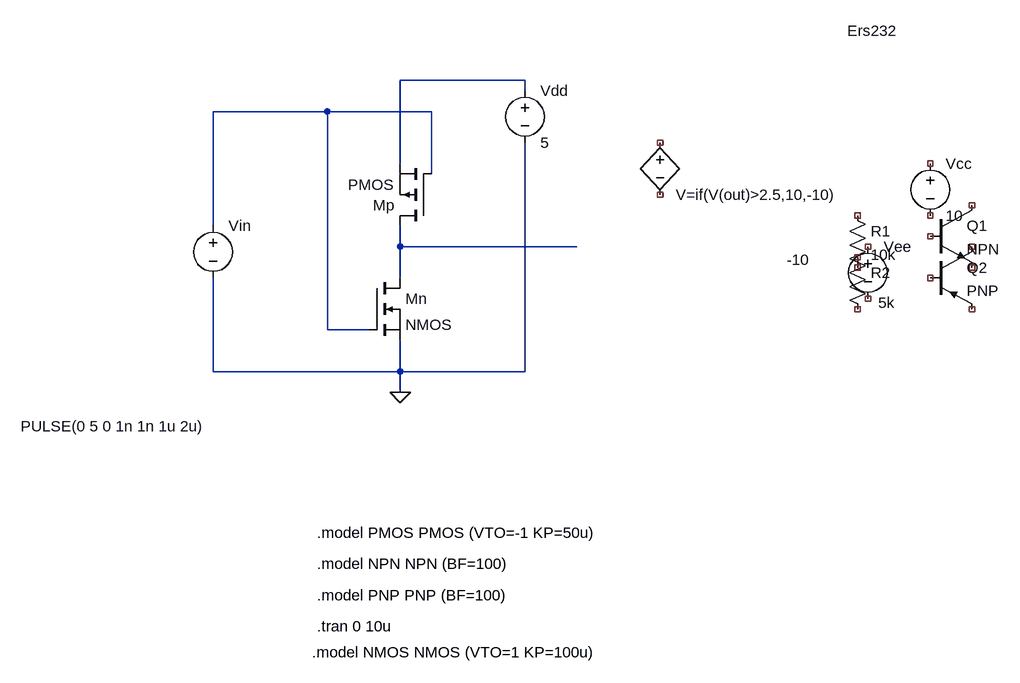
[diagram p0: schematic rs232_chain.asc]
rs232_chain.asc, the LTspice schematic file:
Version 4.1
SHEET 1 1096 832
WIRE 336 -64 144 -64
WIRE 336 -48 336 -64
WIRE 32 -16 -144 -16
WIRE 192 -16 32 -16
WIRE 144 64 144 -64
WIRE 192 80 192 -16
WIRE -144 160 -144 -16
WIRE 144 192 144 160
WIRE 416 192 144 192
WIRE 144 240 144 192
WIRE 32 320 32 -16
WIRE 96 320 32 320
WIRE -144 384 -144 240
WIRE 144 384 144 336
WIRE 144 384 -144 384
WIRE 336 384 336 32
WIRE 336 384 144 384
WIRE 144 416 144 384
FLAG 144 416 0
SYMBOL voltage -144 144 R0
WINDOW 123 0 0 Left 0
WINDOW 3 -296 324 Left 2
SYMATTR InstName Vin
SYMATTR Value PULSE(0 5 0 1n 1n 1u 2u)
SYMBOL voltage 336 -64 R0
WINDOW 123 0 0 Left 0
SYMATTR InstName Vdd
SYMATTR Value 5
SYMBOL nmos 96 240 R0
SYMATTR InstName Mn
SYMBOL pmos 192 160 R180
WINDOW 3 58 63 Left 2
SYMATTR InstName Mp
SYMBOL bv 544 16 R0
WINDOW 0 288 -156 Left 2
SYMATTR InstName Ers232
SYMATTR Value V=if(V(out)>2.5,10,-10)
SYMBOL res 832 128 R0
SYMATTR InstName R1
SYMATTR Value 10k
SYMBOL res 832 192 R0
WINDOW 3 48 86 Left 2
SYMATTR InstName R2
SYMATTR Value 5k
SYMBOL npn 960 128 R0
SYMATTR InstName Q1
SYMBOL pnp 960 192 R0
SYMATTR InstName Q2
SYMBOL voltage 960 48 R0
SYMATTR InstName Vcc
SYMATTR Value 10
SYMBOL voltage 864 176 R0
WINDOW 3 -125 36 Left 2
SYMATTR InstName Vee
SYMATTR Value -10
TEXT 8 816 Left 2 !.model NMOS NMOS (VTO=1 KP=100u)
TEXT 16 632 Left 2 !.model PMOS PMOS (VTO=-1 KP=50u)
TEXT 16 680 Left 2 !.model NPN NPN (BF=100)
TEXT 16 728 Left 2 !.model PNP PNP (BF=100)
TEXT 16 776 Left 2 !.tran 0 10u

The netlist it stands for:
* rs232_chain.asc
Vin N002 0 PULSE(0 5 0 1n 1n 1u 2u)
Vdd N001 0 5
Mn N003 N002 0 0 NMOS
Mp N003 N002 N001 N001 PMOS
B§Ers232 NC_01 NC_02 V=if(V(out)>2.5,10,-10)
R1 NC_03 NC_04 10k
R2 NC_05 NC_06 5k
Q1 NC_07 NC_08 NC_09 0 NPN
Q2 NC_10 NC_11 NC_12 0 PNP
Vcc NC_13 NC_14 10
Vee NC_15 NC_16 -10
.model NPN NPN
.model PNP PNP
.lib standard.bjt
.model NMOS NMOS
.model PMOS PMOS
.lib standard.mos
.model NMOS NMOS (VTO=1 KP=100u)
.model PMOS PMOS (VTO=-1 KP=50u)
.model NPN NPN (BF=100)
.model PNP PNP (BF=100)
.tran 0 10u
.backanno
.end